# EAGLE design Buttons (EAGLE 9.3.0)
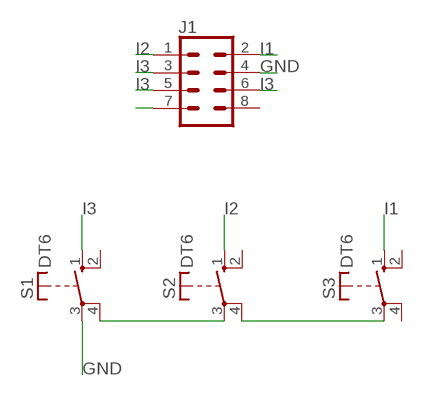
[diagram p0: schematic, sheet 1]

## Parts
J1  CONN_04X2  [2X4]
S1  DT6  [DT6]
S2  DT6  [DT6]
S3  DT6  [DT6]

## Nets
GND: J1.4 S1.3(P)
I1: J1.2 S3.1(S)
I2: J1.1 S2.1(S)
I3: J1.3 J1.5 J1.6 S1.1(S)
N$1: J1.7
N$4: S2.4(P) S3.3(P)
N$5: S1.4(P) S2.3(P)
Unconnected: J1.8 S1.2(S) S2.2(S) S3.2(S) S3.4(P)

## Library data of the parts
J1 = SparkFun-Connectors:CONN_04X2: Multi connection point. Often used as Generic Header-pin footprint for 0.1 inch spaced/style header connections On any of the 0.1 inch spaced packages, you can populate with these: Break Away Headers - Straight <https://www.sparkfun.com/products/116> (PRT-00116) Break Away Male Headers - Right Angle <https://www.sparkfun.com/products/553> (PRT-00553) Female Headers <https://www.sparkfun.com/products/115> (PRT-00115) Break Away Headers - Machine Pin <https://www.sparkfun.com/products/117> (PRT-00117) Break Away Female Headers - Swiss Machine Pin <https://www.sparkfun.com/products/743> (PRT-00743)
S1-S3 = switch-misc:DT: ITT SWITCH

## Net classes
0 default: width 0.5 mm

## Board
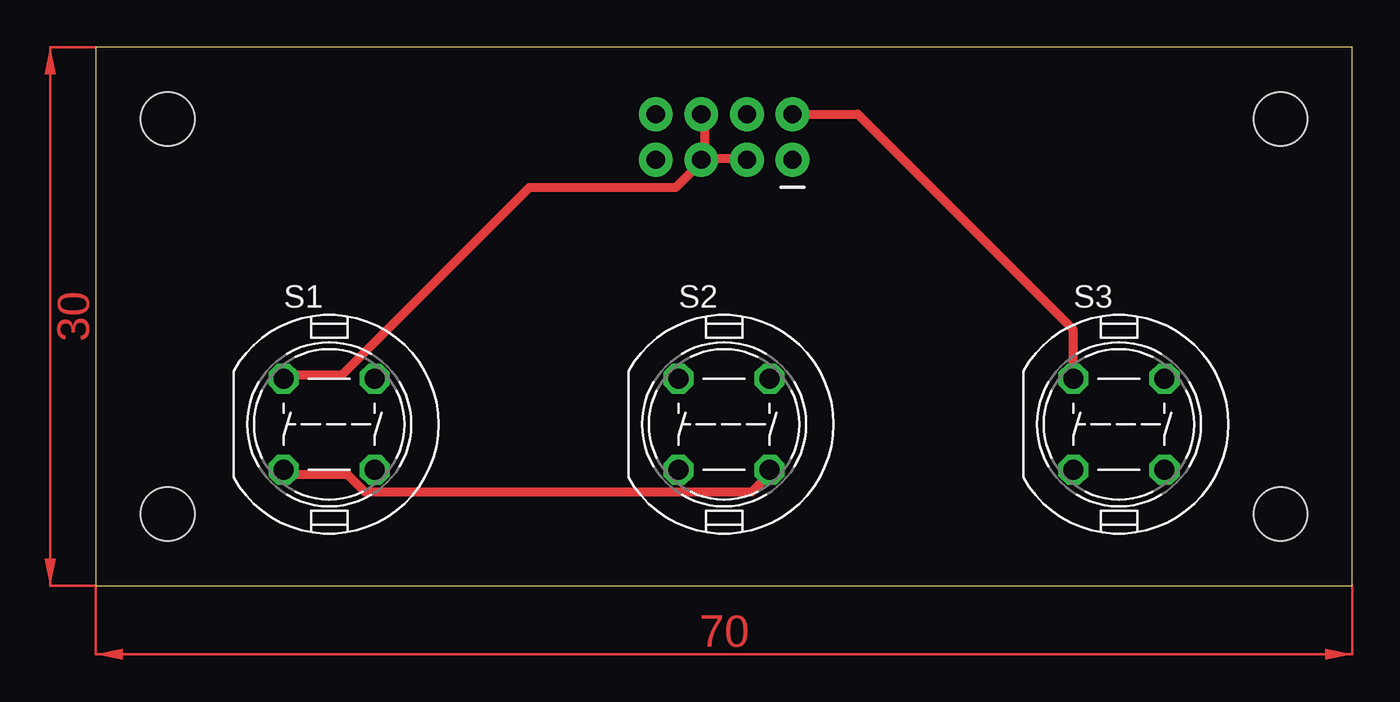
[diagram p1: board, top side]
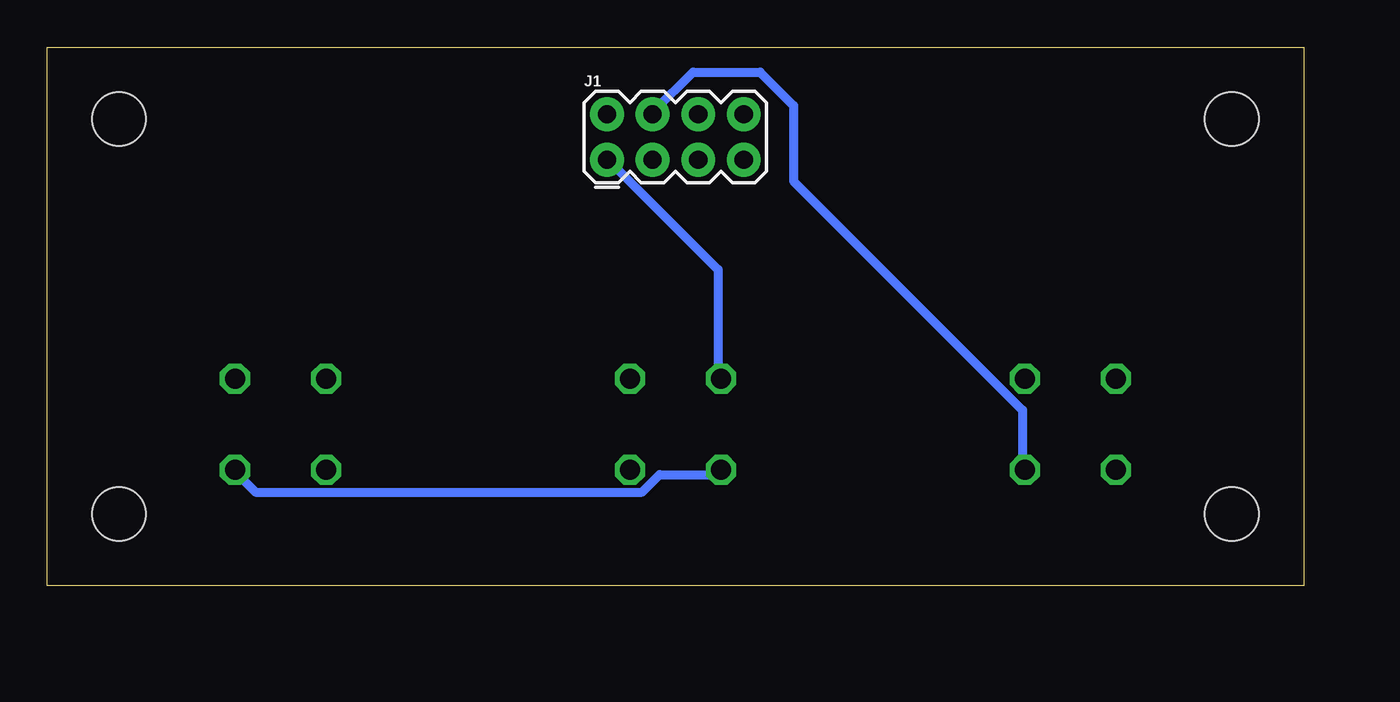
[diagram p2: board, bottom side, seen from below]

Size 70 x 30 mm. Coordinates in mm from the lower left corner, seen from the top.
Outline: 0,0 70,0 70,30 0,30 0,0
Copper layers (1*16): Top 0.035mm / dielectric 1.5mm / Bottom 0.035mm
Design rules "default": minimum track width 6mil, minimum drill 0.35mm, track to track 6mil, track to pad 6mil, pad to pad 6mil, via to via 6mil, smd to smd 6mil, copper to edge 40mil, drill to drill 6mil, minimum pad ring 10mil, minimum via ring 8mil, stop-mask expansion 4mil, vias tented up to drill 0mil, thermal gap 10mil
Holes 3 mm at 4,26 4,4 66,26 66,4

### Footprints (pad centres in the part's own frame; a part is rotated, then mirrored left to right if it is on the bottom)
2X4 = drill 1.016 pad 1.88: 1 -3.81,-1.27; 2 -3.81,1.27; 3 -1.27,-1.27; 4 -1.27,1.27; 5 1.27,-1.27; 6 1.27,1.27; 7 3.81,-1.27; 8 3.81,1.27
DT6 = drill 1.118 octagon: 1 -2.54,2.54; 2 2.54,2.54; 3 2.54,-2.54; 4 -2.54,-2.54

### Placement (x,y rotation side)
J1  35,25 0 bottom
S1  13,9 0 top
S2  35,9 0 top
S3  57,9 0 top

### Tracks (layer width: path | path; a pad name or v marks a point on that pad's centre or on a via)
GND
  Bottom 0.5: S1.3 15.66,6.52 15.66,9.79 28.41,22.54 28.41,26.75 30.28,28.62 34.01,28.62 36.21,26.42 J1.4
I1
  Top 0.5: J1.2 42.45,26.27 54.46,14.26 S3.1
I2
  Bottom 0.5: S2.1 32.62,11.74 32.62,17.61 38.49,23.49 J1.1
I3
  Top 0.5: S1.1 10.77,11.74 13.7,11.74 24.14,22.18 32.29,22.18 33.6,23.49 J1.5 33.92,23.81 | 33.92,23.81 33.92,26.1 J1.6 | 33.92,23.81 36.21,23.81 J1.3
N$4
  Bottom 0.5: S2.4 32.62,6.2 35.88,6.2 36.86,5.22 58.39,5.22 59.37,6.2 S3.3
N$5
  Top 0.5: S1.4 10.77,6.2 14.03,6.2 15.01,5.22 36.53,5.22 37.51,6.2 S2.3
(copper drawn outside any net)
  shapes: Top area x2